# Altium schematic sheet PZ127-2-20-Z1_PZ127-2-20-Z.schdoc
size 127 x 99 mm
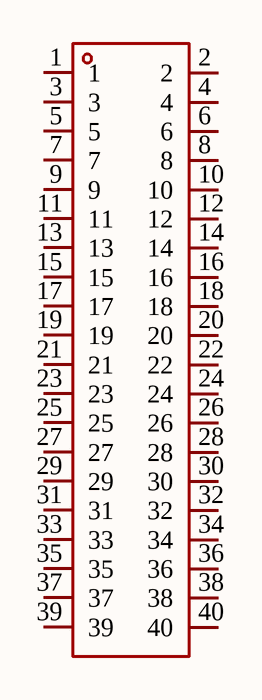
[diagram p0: PZ127-2-20-Z1_PZ127-2-20-Z.schdoc]

## Parts
U?  PZ127-2-20-Z  [HDR-TH_40P-P1.27-V-M-R2-C20-S1.27]  (value not drawn)

## Nets

Not connected (* = marked no-connect by the designer): U? 1 2 3 4 5 6 7 8 9 10 11 12 13 14 15 16 17 18 19 20 21 22 23 24 25 26 27 28 29 30 31 32 33 34 35 36 37 38 39 40

## Library data of the parts
U? = PZ127-2-20-Z: Manufacturer: HCTL(华灿天禄); Add into BOM: yes; Pin Structure: 2x20P; Pitch: 1.27mm; Circluar Pins/Square Pins: 方针; Current Rating (Max): 1A; Voltage Rating (Max): 500V; Soldering Temperature(Max): 260℃@10S; Symbol: PZ127-2-20-Z; Device: PZ127-2-20-Z; LCSC Part Name: 2x20P 间距:1.27mm 方针 直插; Supplier Part: C5372824; Manufacturer Part: PZ127-2-20-Z; Supplier Footprint: 插件,P=1.27mm; JLCPCB Part Class: Extended Part; Datasheet: https://atta.szlcsc.com/upload/public/pdf/source/20240702/A94E5E2C58EC168531668174128D95E4.pdf; Supplier: LCSC; Convert to PCB: yes; Row Spacing: 1.27mm; Mounting Type: 直插; Number of Rows: 双排; Number of Pins: 40P; Length of Mating Pin: 3.8mm; Insulation Height: 1mm; Length of End Connection Pin: 2.4mm; Contact Material: 黄铜; Contact Plating: -; Operating Temperature Range: -40℃~+105℃; Color: 黑色